# Altium project OurEDA-P1K.PrjPcb
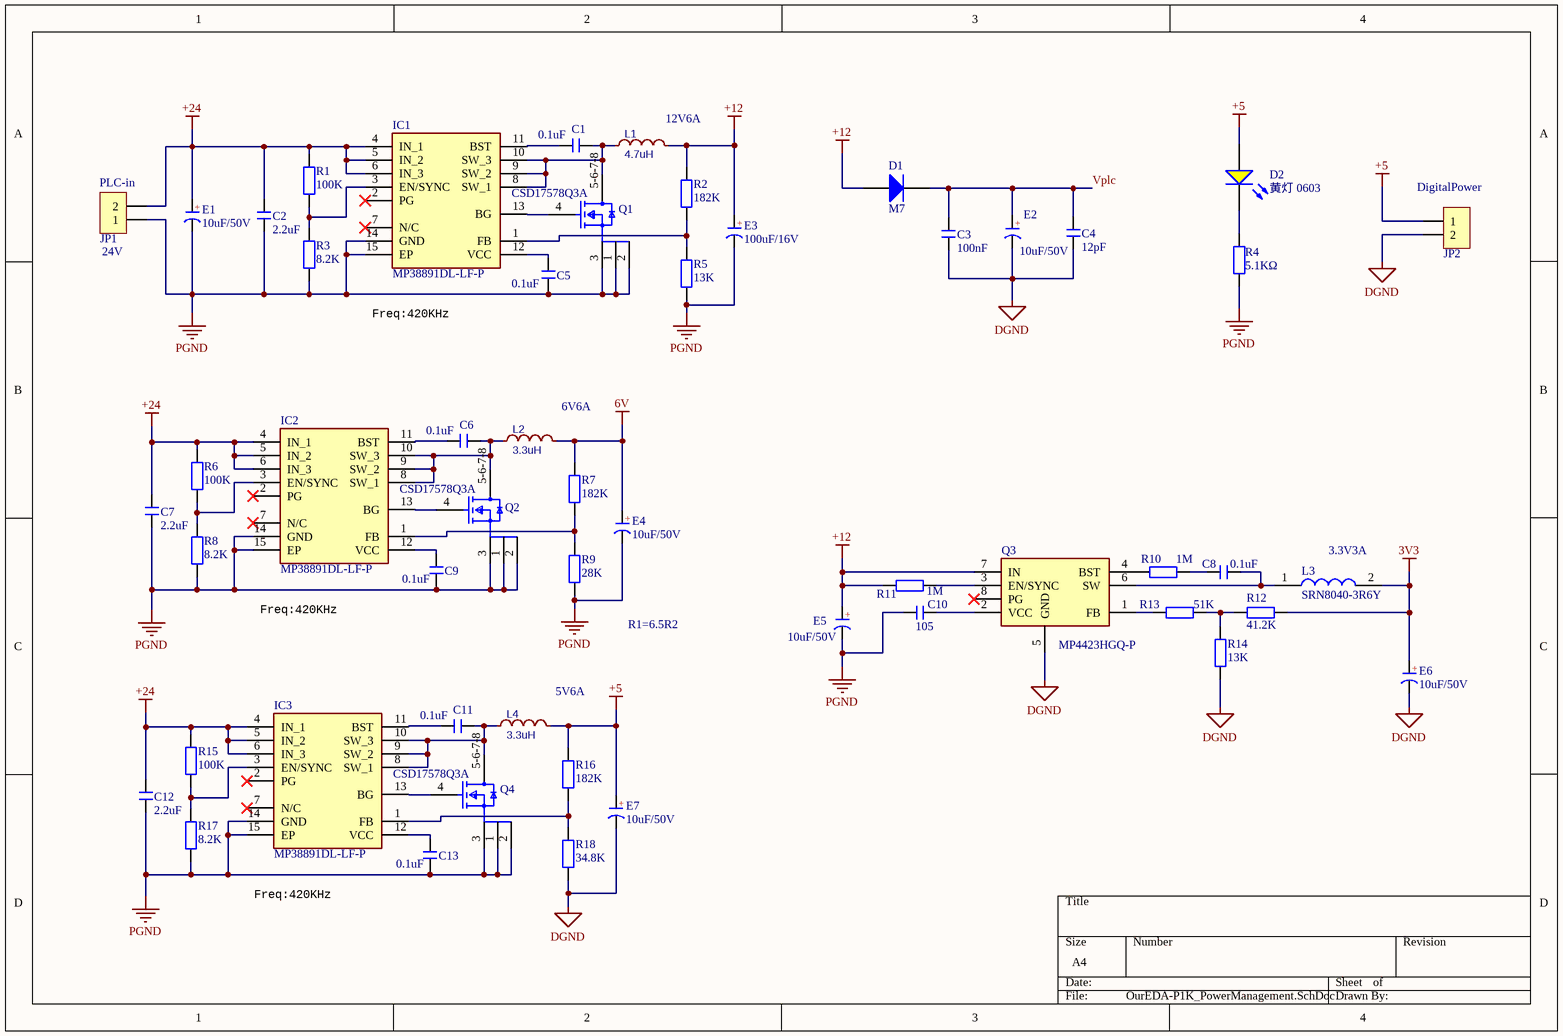
[diagram p0: OurEDA-P1K_PowerManagement.SchDoc]
7 sheets, 226 parts. Net scope: global (net labels, ports and power ports of the same name join across sheets).
Board file: OurEDA-P1K.PcbDoc
Sheets:
  OurEDA-P1K_PowerManagement.SchDoc
  OurEDA-P1K_Network.SchDoc
  OurEDA-P1K_zynq.SchDoc
  OurEDA-P1K_sensor.SchDoc
  OurEDA-P1K_cam.SchDoc
  OurEDA-P1K_usb.SchDoc
  OurEDA-P1K_sd.SchDoc

## Sheet OurEDA-P1K_PowerManagement.SchDoc
size A4; SheetNumber: 1; SheetTotal: 7

### Parts
C1  0.1uF  [C 0603_L]
C2  2.2uF  [C 0805_L]
C3  100nF  [C 0603_L]
C4  12pF  [C 0603_L]
C5  0.1uF  [C 0603_L]
C6  0.1uF  [C 0603_L]
C7  2.2uF  [C 0805_L]
C8  0.1uF  [C 0603_L]
C9  0.1uF  [C 0603_L]
C10  105  [C 0603_L]
C11  0.1uF  [C 0603_L]
C12  2.2uF  [C 0805_L]
C13  0.1uF  [C 0603_L]
D1  M7  [SMA(DO-214AC)_S1]
D2  黄灯 0603  [0603_LED_S1]
E1  10uF/50V  [CM D(6.3*5.4)]
E2  10uF/50V  [CM B(4*5.4)]
E3  100uF/16V  [CM D(6.3*5.4)]
E4  10uF/50V  [CM B(4*5.4)]
E5  10uF/50V  [CM B(4*5.4)]
E6  10uF/50V  [CM B(4*5.4)]
E7  10uF/50V  [CM B(4*5.4)]
IC1  MP38891DL-LF-P  [SON50P300X400X100-15N-D]
IC2  MP38891DL-LF-P  [SON50P300X400X100-15N-D]
IC3  MP38891DL-LF-P  [SON50P300X400X100-15N-D]
JP1  HDR-1X2  [KF128-5.08-2P]  (value not drawn)
JP2  HDR-1X2  [HDR2.54-LI-2P]  (value not drawn)
L1  4.7uH  [220uH]
L2  3.3uH  [220uH]
L3  SRN8040-3R6Y  [SRN80408R2Y]
L4  3.3uH  [220uH]
Q1  CSD17578Q3A  [FP-DNH0008A-MFG]
Q2  CSD17578Q3A  [FP-DNH0008A-MFG]
Q3  MP4423HGQ-P  [MP4423GQP]
Q4  CSD17578Q3A  [FP-DNH0008A-MFG]
R1  100K  [R 0603_L]
R2  182K  [R 0603_L]
R3  8.2K  [R 0603_L]
R4  5.1KΩ  [0603_R]
R5  13K  [R 0603_L]
R6  100K  [R 0603_L]
R7  182K  [R 0603_L]
R8  8.2K  [R 0603_L]
R9  28K  [R 0603_L]
R10  1M  [R 0603_L]
R11  1M  [R 0603_L]
R12  41.2K  [R 0603_L]
R13  51K  [R 0603_L]
R14  13K  [R 0603_L]
R15  100K  [R 0603_L]
R16  182K  [R 0603_L]
R17  8.2K  [R 0603_L]
R18  34.8K  [R 0603_L]

### Nets
3V3: E6.1(A) L3.2 R12.2
6V: E4.1(A) L2.2 R7.2
+5: D2.A E7.1(A) JP2.1 L4.2 R16.2
+12: D1.1(A) E3.1(A) E5.1(A) L1.2 Q3.7(IN) R2.2 R11.2
+24: C2.2 C7.2 C12.2 E1.1(A) IC1.4(IN_1) IC1.5(IN_2) IC1.6(IN_3) IC2.4(IN_1) IC2.5(IN_2) IC2.6(IN_3) IC3.4(IN_1) IC3.5(IN_2) IC3.6(IN_3) JP1.2 R1.2 R6.2 R15.2
DGND: C3.2 C4.2 E2.2(K) E6.2(K) E7.2(K) JP2.2 Q3.5(GND) R14.2 R18.1
PGND: C2.1 C5.2 C7.1 C9.2 C10.1 C12.1 C13.2 E1.2(K) E3.2(K) E4.2(K) E5.2(K) IC1.14(GND) IC1.15(EP) IC2.14(GND) IC2.15(EP) IC3.14(GND) IC3.15(EP) JP1.1 Q1.1(S) Q1.2(S) Q1.3(S) Q2.1(S) Q2.2(S) Q2.3(S) Q4.1(S) Q4.2(S) Q4.3(S) R3.1 R4.2 R5.1 R8.1 R9.1 R17.1
Vplc: C3.1 C4.1 D1.2(K) E2.1(A)
NetC1_1: C1.1 IC1.8(SW_1) IC1.9(SW_2) IC1.10(SW_3) L1.1 Q1.5-6-7-8(D)
NetC1_2: C1.2 IC1.11(BST)
NetC5_1: C5.1 IC1.12(VCC)
NetC6_1: C6.1 IC2.8(SW_1) IC2.9(SW_2) IC2.10(SW_3) L2.1 Q2.5-6-7-8(D)
NetC6_2: C6.2 IC2.11(BST)
NetC8_1: C8.1 L3.1 Q3.6(SW)
NetC8_2: C8.2 R10.1
NetC9_1: C9.1 IC2.12(VCC)
NetC10_2: C10.2 Q3.2(VCC)
NetC11_1: C11.1 IC3.8(SW_1) IC3.9(SW_2) IC3.10(SW_3) L4.1 Q4.5-6-7-8(D)
NetC11_2: C11.2 IC3.11(BST)
NetC13_1: C13.1 IC3.12(VCC)
NetD2_K: D2.K R4.1
NetIC1_1: IC1.1(FB) R2.1 R5.2
NetIC1_3: IC1.3(EN/SYNC) R1.1 R3.2
NetIC1_13: IC1.13(BG) Q1.4(G)
NetIC2_1: IC2.1(FB) R7.1 R9.2
NetIC2_3: IC2.3(EN/SYNC) R6.1 R8.2
NetIC2_13: IC2.13(BG) Q2.4(G)
NetIC3_1: IC3.1(FB) R16.1 R18.2
NetIC3_3: IC3.3(EN/SYNC) R15.1 R17.2
NetIC3_13: IC3.13(BG) Q4.4(G)
NetQ3_1: Q3.1(FB) R13.2
NetQ3_3: Q3.3(EN/SYNC) R11.1
NetQ3_4: Q3.4(BST) R10.2
NetR12_1: R12.1 R13.1 R14.1

Not connected (* = marked no-connect by the designer): IC1 2(PG)* 7(N/C)*; IC2 2(PG)* 7(N/C)*; IC3 2(PG)* 7(N/C)*; Q3 8(PG)*

### Notes on the sheet
- (near L1) 12V6A
- (near JP1) PLC-in
- (near JP2) DigitalPower
- (near JP1) 24V
- Freq:420KHz
- (near L2) 6V6A
- (near L3) 3.3V3A
- R1=6.5R2
- (near L4) 5V6A
- (in symbol C-CM) +

### Library data of the parts
C1-C13 = C: 无极性贴片电容; 版权归属: 源创客; BOM名称: 无极性贴片电容; 学习资源: www.ooocke.com
D1 = SMA(DO-214AC) M7: 二极管; Notepad: 1N4007 4007 编号C2464 已经停售, 使用新物料编号C95872; ComponentLink1Description: 供应商链接; ComponentLink1URL: http://www.szlcsc.com/product/details_2841.html; Package: SMA(DO-214AC); Supplier: LC; SuppliersPartNumber: C95872
D2 = 0603 黄灯: 发光二极管; ComponentLink1Description: 供应商链接; ComponentLink1URL: http://www.szlcsc.com/product/details_73147.html; Package: 0603; Supplier: LC; SuppliersPartNumber: C72038
E1-E7 = C-CM: 贴片电解电容; 版权归属: 源创客; BOM名称: 贴片电解电容; 学习资源: www.ooocke.com
IC1-IC3 = MP38891DL-LF-P: Integrated Circuit; Manufacturer_Name: Monolithic Power Systems (MPS); Datasheet Link: https://componentsearchengine.com/Datasheets/1/MP38891DL-LF-P.pdf; Height: 1mm; Manufacturer_Part_Number: MP38891DL-LF-P; Mouser Part Number: 946-MP38891DLLFP; Mouser Price/Stock: https://www.mouser.com/Search/Refine.aspx?Keyword=946-MP38891DLLFP
JP1 JP2 = Header 2: 2P接插件; 版权归属: 源创客; BOM名称: 2P接插件; 学习资源: www.ooocke.com
L1 L2 L4 = 220uH: BOM_Manufacturer: Sunltech Tech; BOM_Manufacturer Part: SLO1235H220MTT; nameAlias: Inductance; Contributor: LCSC; BOM_Supplier: LCSC; BOM_Supplier Part: C364099; spicePre: L; spiceSymbolName: SLO1235H220MTT
L3 = SRN8040-3R6Y: Inductor; Manufacturer_Name: Bourns; Datasheet Link: https://www.bourns.com/docs/Product-Datasheets/SRN8040.pdf; Height: 4mm; Manufacturer_Part_Number: SRN8040-3R6Y; Arrow Part Number: SRN8040-3R6Y; Arrow Price/Stock: https://www.arrow.com/en/products/srn8040-3r6y/bourns; Mouser Part Number: 652-SRN8040-3R6Y; Mouser Price/Stock: https://www.mouser.com/Search/Refine.aspx?Keyword=652-SRN8040-3R6Y
Q1 Q2 Q4 = CMP-04962-000065-1: MOSFET N-CH 30V 35A 8VSON; Turn-On Delay Time: 2ns; Rds On Max: 7.3mR; Fall Time: 1ns; Gate to Source Voltage (Vgs): 20V; Turn-Off Delay Time: 13ns; Rise Time: 6ns; Max Power Dissipation: 3.2W; Input Capacitance: 1.59nF; Element Configuration: Single; Continuous Drain Current (ID): 20A; Drain to Source Voltage (Vdss): 30V; Packaging: Tape and Reel; Lead Free: Lead Free; Mount: Surface Mount; Number of Pins: 8; Contact Plating: Copper; Min Operating Temperature: -55°C; Max Operating Temperature: 150°C; RoHS Compliant: Yes
Q3 = MP4423HGQ-P: Transistor; Manufacturer_Name: Monolithic Power Systems (MPS); Datasheet Link: https://componentsearchengine.com/Datasheets/1/MP4423HGQ-P.pdf; Height: 1mm; Manufacturer_Part_Number: MP4423HGQ-P; Mouser Part Number: 946-MP4423HGQ-P; Mouser Price/Stock: https://www.mouser.co.uk/ProductDetail/Monolithic-Power-Systems-MPS/MP4423HGQ-P?qs=493kPxzlxfL2LSjJYToBPQ%3D%3D
R1-R3 R5-R18 = R: 贴片电阻; 版权归属: 源创客; BOM名称: 贴片电阻; 学习资源: www.ooocke.com
R4 = 0603 3.3KΩ (3301) 1%: 贴片电阻; ComponentLink1Description: 供应商链接; ComponentLink1URL: http://www.szlcsc.com/product/details_23705.html; Package: 0603; Supplier: LC; SuppliersPartNumber: C22978

## Sheet OurEDA-P1K_Network.SchDoc
size A4; SheetNumber: 2; SheetTotal: 7
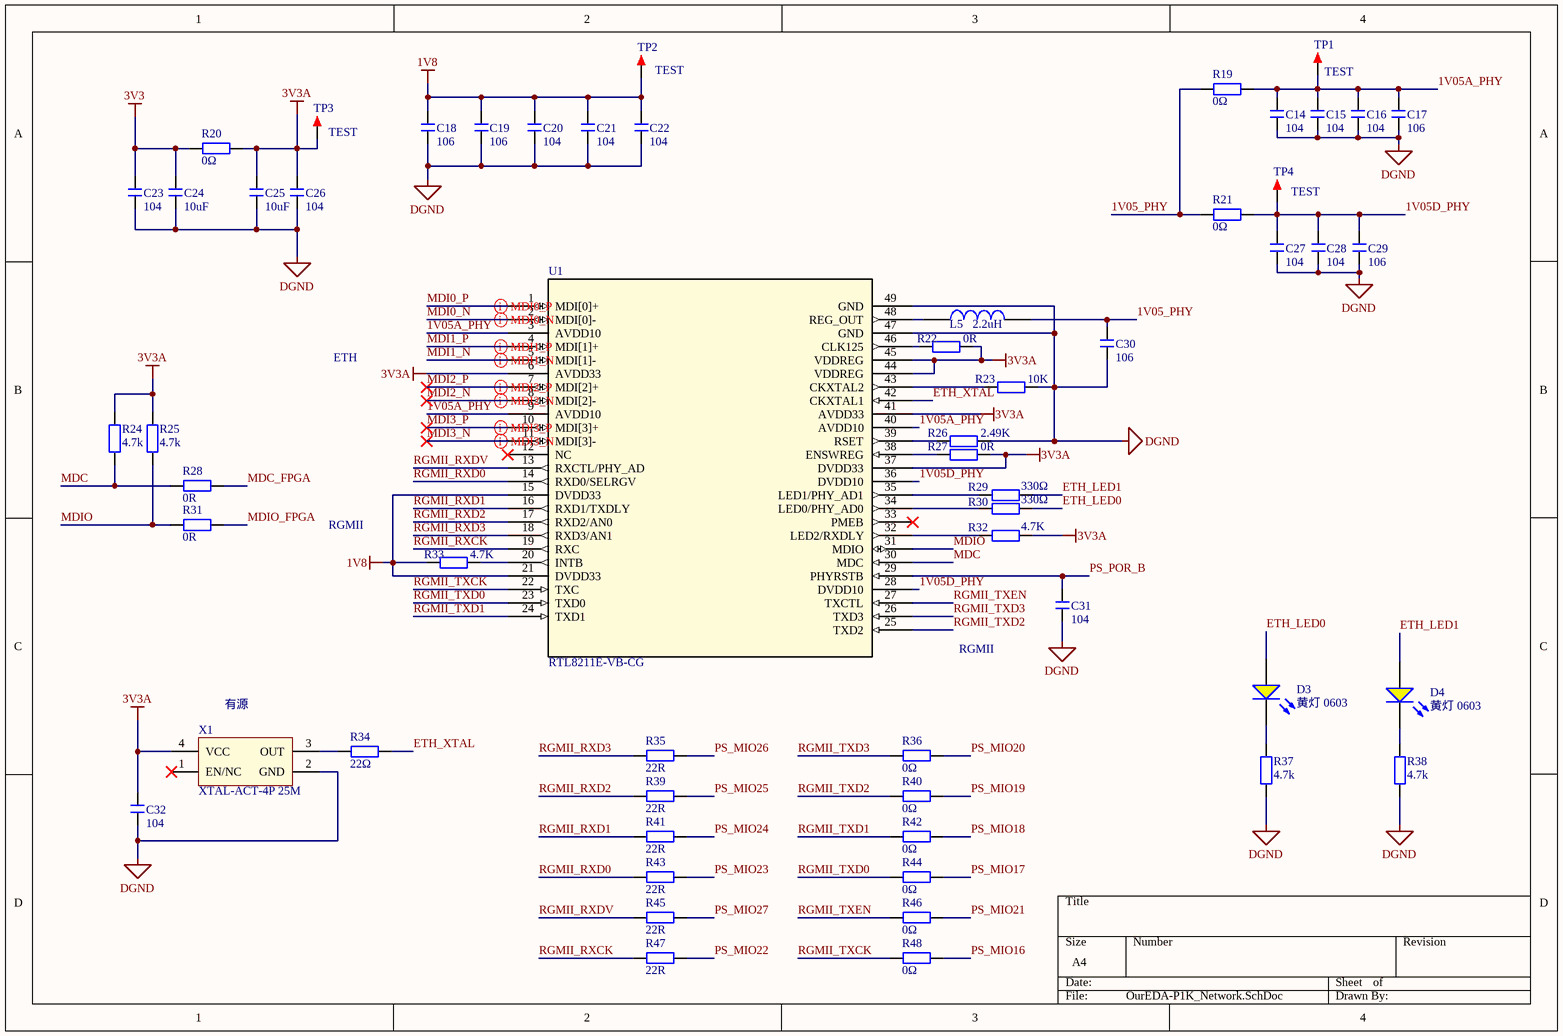
[diagram p1: OurEDA-P1K_Network.SchDoc]

### Parts
C14  104  [C 0603_L]
C15  104  [C 0603_L]
C16  104  [C 0603_L]
C17  106  [C 0603_L]
C18  106  [C 0603_L]
C19  106  [C 0603_L]
C20  104  [C 0603_L]
C21  104  [C 0603_L]
C22  104  [C 0603_L]
C23  104  [C 0603_L]
C24  10uF  [C 0603_L]
C25  10uF  [C 0603_L]
C26  104  [C 0603_L]
C27  104  [C 0603_L]
C28  104  [C 0603_L]
C29  106  [C 0603_L]
C30  106  [C 0603_L]
C31  104  [C 0603_L]
C32  104  [C 0603_L]
D3  黄灯 0603  [0603_LED_S1]
D4  黄灯 0603  [0603_LED_S1]
L5  2.2uH  [0805L]
R19  0Ω  [R 0603_L]
R20  0Ω  [R 0805_L]
R21  0Ω  [R 0603_L]
R22  0R  [R 0603_L]
R23  10K  [R 0603_L]
R24  4.7k  [R 0603_L]
R25  4.7k  [R 0603_L]
R26  2.49K  [R 0603_L]
R27  0R  [R 0603_L]
R28  0R  [R 0603_L]
R29  330Ω  [R 0603_L]
R30  330Ω  [R 0603_L]
R31  0R  [R 0603_L]
R32  4.7K  [R 0603_L]
R33  4.7K  [R 0603_L]
R34  22Ω  [R 0603_L]
R35  22R  [R 0603_L]
R36  0Ω  [R 0603_L]
R37  4.7k  [R 0603_L]
R38  4.7k  [R 0603_L]
R39  22R  [R 0603_L]
R40  0Ω  [R 0603_L]
R41  22R  [R 0603_L]
R42  0Ω  [R 0603_L]
R43  22R  [R 0603_L]
R44  0Ω  [R 0603_L]
R45  22R  [R 0603_L]
R46  0Ω  [R 0603_L]
R47  22R  [R 0603_L]
R48  0Ω  [R 0603_L]
TP1  TEST  [TEST 1]
TP2  TEST  [TEST 1]
TP3  TEST  [TEST 1]
TP4  TEST  [TEST 1]
U1  RTL8211E-VB-CG  [QFN48 6X6]
X1  XTAL-ACT-4P 25M  [OSC 1612-4P]

### Nets
1V8: C18.2 C19.2 C20.2 C21.2 C22.2 R33.2 TP2.1 U1.15(DVDD33) U1.21(DVDD33)
3V3: C23.2 C24.2 R20.1
3V3A: C25.2 C26.2 C32.2 R20.2 R22.1 R24.1 R25.1 R27.1 R32.1 TP3.1 U1.6(AVDD33) U1.37(DVDD33) U1.41(AVDD33) U1.44(VDDREG) U1.45(VDDREG) X1.4(VCC)
DGND: C14.1 C15.1 C16.1 C17.1 C18.1 C19.1 C20.1 C21.1 C22.1 C23.1 C24.1 C25.1 C26.1 C27.1 C28.1 C29.1 C30.2 C31.2 C32.1 R23.1 R26.1 R37.1 R38.1 U1.47(GND) U1.49(GND) X1.2(GND)
1V05_PHY: C30.1 L5.2 R19.1 R21.1
1V05A_PHY: C14.2 C15.2 C16.2 C17.2 R19.2 TP1.1 U1.3(AVDD10) U1.9(AVDD10) U1.40(AVDD10)
1V05D_PHY: C27.2 C28.2 C29.2 R21.2 TP4.1 U1.28(DVDD10) U1.36(DVDD10)
ETH_LED0: D3.A R30.1
ETH_LED1: D4.A R29.1
ETH_XTAL: R34.2 U1.42(CKXTAL1)
MDC: R24.2 R28.2 U1.30(MDC)
MDC_FPGA: R28.1
MDI0_N: U1.2(MDI[0]-)
MDI0_P: U1.1(MDI[0]+)
MDI1_N: U1.5(MDI[1]-)
MDI1_P: U1.4(MDI[1]+)
MDI2_N: U1.8(MDI[2]-)
MDI2_P: U1.7(MDI[2]+)
MDI3_N: U1.11(MDI[3]-)
MDI3_P: U1.10(MDI[3]+)
MDIO: R25.2 R31.2 U1.31(MDIO)
MDIO_FPGA: R31.1
PS_MIO16: R48.2
PS_MIO17: R44.2
PS_MIO18: R42.2
PS_MIO19: R40.2
PS_MIO20: R36.2
PS_MIO21: R46.2
PS_MIO22: R47.2
PS_MIO23: R43.2
PS_MIO24: R41.2
PS_MIO25: R39.2
PS_MIO26: R35.2
PS_MIO27: R45.2
PS_POR_B: C31.1 U1.29(PHYRSTB)
RGMII_RXCK: R47.1 U1.19(RXC)
RGMII_RXD0: R43.1 U1.14(RXD0/SELRGV)
RGMII_RXD1: R41.1 U1.16(RXD1/TXDLY)
RGMII_RXD2: R39.1 U1.17(RXD2/AN0)
RGMII_RXD3: R35.1 U1.18(RXD3/AN1)
RGMII_RXDV: R45.1 U1.13(RXCTL/PHY_AD)
RGMII_TXCK: R48.1 U1.22(TXC)
RGMII_TXD0: R44.1 U1.23(TXD0)
RGMII_TXD1: R42.1 U1.24(TXD1)
RGMII_TXD2: R40.1 U1.25(TXD2)
RGMII_TXD3: R36.1 U1.26(TXD3)
RGMII_TXEN: R46.1 U1.27(TXCTL)
NetD3_K: D3.K R37.2
NetD4_K: D4.K R38.2
NetL5_1: L5.1 U1.48(REG_OUT)
NetR22_2: R22.2 U1.46(CLK125)
NetR23_2: R23.2 U1.43(CKXTAL2)
NetR26_2: R26.2 U1.39(RSET)
NetR27_2: R27.2 U1.38(ENSWREG)
NetR29_2: R29.2 U1.35(LED1/PHY_AD1)
NetR30_2: R30.2 U1.34(LED0/PHY_AD0)
NetR32_2: R32.2 U1.32(LED2/RXDLY)
NetR33_1: R33.1 U1.20(INTB)
NetR34_1: R34.1 X1.3(OUT)

Not connected (* = marked no-connect by the designer): U1 12(NC)* 33(PMEB)*; X1 1(EN/NC)*

### Layout directives
differential pair: MDI0_N, MDI0_P, MDI1_N, MDI1_P, MDI2_N, MDI2_P, MDI3_N, MDI3_P

### Notes on the sheet
- ETH
- RGMII
- (near X1) 有源

### Library data of the parts
C14-C32 = C: 无极性贴片电容; 版权归属: 源创客; BOM名称: 无极性贴片电容; 学习资源: www.ooocke.com
D3 D4 = 0603 黄灯: 发光二极管; ComponentLink1Description: 供应商链接; ComponentLink1URL: http://www.szlcsc.com/product/details_73147.html; Package: 0603; Supplier: LC; SuppliersPartNumber: C72038
L5 = INDUCTOR
R19-R48 = R: 贴片电阻; 版权归属: 源创客; BOM名称: 贴片电阻; 学习资源: www.ooocke.com
TP1-TP4 = TEST: 测试点; 版权归属: 源创客; BOM名称: 测试点; 学习资源: www.ooocke.com
U1 = RTL8211E-VB-CG: No Description Available; Mfr_Name: Realtek; Copyright: Copyright (C) 2022 Ultra Librarian. All rights reserved.; Manufacturer_Part_Number: RTL8211E-VB-CG; RefDes: RefDes; Type: DEV
X1 = XTAL-ACT-4P: 4脚有源晶振

## Sheet OurEDA-P1K_zynq.SchDoc
size A4; SheetNumber: 3; SheetTotal: 7
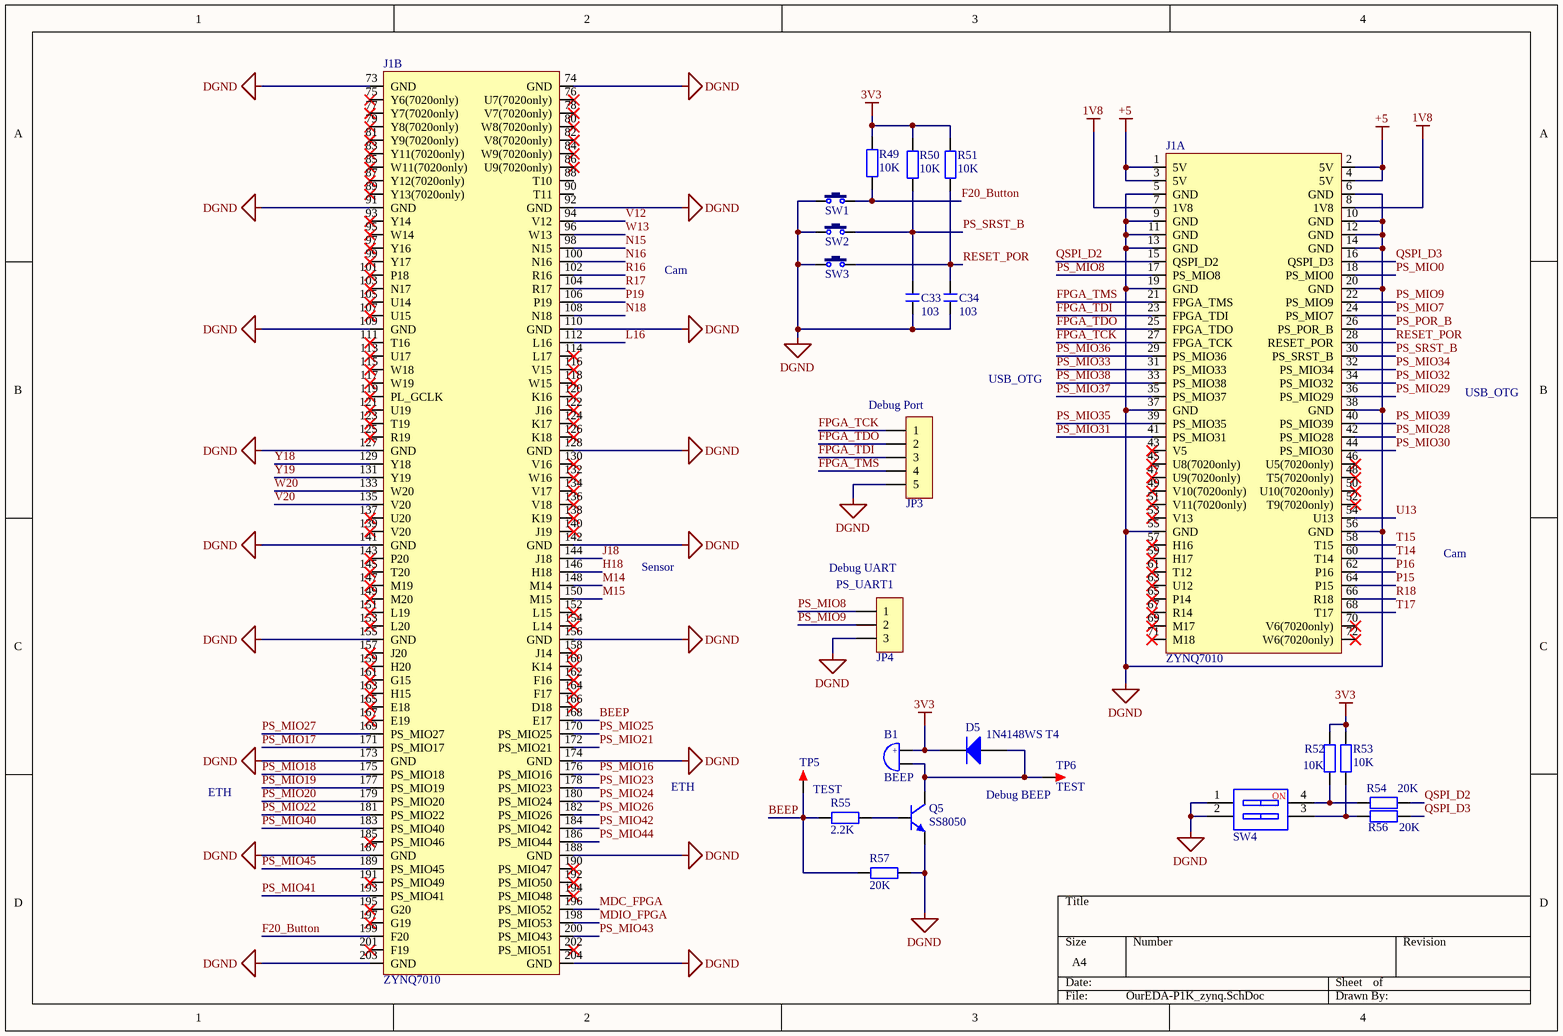
[diagram p2: OurEDA-P1K_zynq.SchDoc]

### Parts
B1  BEEP  [BEEP 5x9x5.5]
C33  103  [C 0603_L]
C34  103  [C 0603_L]
D5  1N4148WS T4  [SOD-323]
J1  ZYNQ7010  [DDR3_sodimm_Pin204]  (parts A,B of 2)
JP3  HDR-1X5  [MX 1.25-LS-5P]  (value not drawn)
JP4  HDR-1X3  [MX 1.25-LS-3P]  (value not drawn)
Q5  SS8050  [SOT23-3N]
R49  10K  [R 0603_L]
R50  10K  [R 0603_L]
R51  10K  [R 0603_L]
R52  10K  [R 0603_L]
R53  10K  [R 0603_L]
R54  20K  [R 0603_L]
R55  2.2K  [R 0603_L]
R56  20K  [R 0603_L]
R57  20K  [R 0603_L]
SW1  3x6x5  [TSW SMD-3*6*2.5]  (value not drawn)
SW2  3x6x5  [TSW SMD-3*6*2.5]  (value not drawn)
SW3  3x6x5  [TSW SMD-3*6*2.5]  (value not drawn)
SW4  CSW-2P  [CSW1.27 SMD-2P]  (value not drawn)
TP5  TEST  [TEST 1]
TP6  TEST  [TEST 1]

### Nets
1V8: J1.7(1V8) J1.8(1V8)
3V3: B1.1 D5.2(K) R49.2 R50.2 R51.2 R52.2 R53.2
+5: J1.1(5V) J1.2(5V) J1.3(5V) J1.4(5V)
DGND: C33.1 C34.1 J1.5(GND) J1.6(GND) J1.9(GND) J1.10(GND) J1.11(GND) J1.12(GND) J1.13(GND) J1.14(GND) J1.19(GND) J1.20(GND) J1.37(GND) J1.38(GND) J1.55(GND) J1.56(GND) J1.73(GND) J1.74(GND) J1.91(GND) J1.92(GND) J1.109(GND) J1.110(GND) J1.127(GND) J1.128(GND) J1.141(GND) J1.142(GND) J1.155(GND) J1.156(GND) J1.173(GND) J1.174(GND) J1.187(GND) J1.188(GND) J1.203(GND) J1.204(GND) JP3.5 JP4.3 Q5.2(E) R57.2 SW1.1 SW2.1 SW3.1 SW4.1 SW4.2
BEEP: J1.168(E17) R55.2 R57.1 TP5.1
F20_Button: J1.199(F20) R49.1 SW1.2
FPGA_TCK: J1.27(FPGA_TCK) JP3.1
FPGA_TDI: J1.23(FPGA_TDI) JP3.3
FPGA_TDO: J1.25(FPGA_TDO) JP3.2
FPGA_TMS: J1.21(FPGA_TMS) JP3.4
H18: J1.146(H18)
J18: J1.144(J18)
L16: J1.112(L16)
M14: J1.148(M14)
M15: J1.150(M15)
MDC_FPGA: J1.196(PS_MIO52)
MDIO_FPGA: J1.198(PS_MIO53)
N15: J1.98(N15)
N16: J1.100(N16)
N18: J1.108(N18)
P15: J1.64(P15)
P16: J1.62(P16)
P19: J1.106(P19)
PS_MIO0: J1.18(PS_MIO0)
PS_MIO7: J1.24(PS_MIO7)
PS_MIO8: J1.17(PS_MIO8) JP4.1
PS_MIO9: J1.22(PS_MIO9) JP4.2
PS_MIO16: J1.176(PS_MIO16)
PS_MIO17: J1.171(PS_MIO17)
PS_MIO18: J1.175(PS_MIO18)
PS_MIO19: J1.177(PS_MIO19)
PS_MIO20: J1.179(PS_MIO20)
PS_MIO21: J1.172(PS_MIO21)
PS_MIO22: J1.181(PS_MIO22)
PS_MIO23: J1.178(PS_MIO23)
PS_MIO24: J1.180(PS_MIO24)
PS_MIO25: J1.170(PS_MIO25)
PS_MIO26: J1.182(PS_MIO26)
PS_MIO27: J1.169(PS_MIO27)
PS_MIO28: J1.42(PS_MIO28)
PS_MIO29: J1.36(PS_MIO29)
PS_MIO30: J1.44(PS_MIO30)
PS_MIO31: J1.41(PS_MIO31)
PS_MIO32: J1.34(PS_MIO32)
PS_MIO33: J1.31(PS_MIO33)
PS_MIO34: J1.32(PS_MIO34)
PS_MIO35: J1.39(PS_MIO35)
PS_MIO36: J1.29(PS_MIO36)
PS_MIO37: J1.35(PS_MIO37)
PS_MIO38: J1.33(PS_MIO38)
PS_MIO39: J1.40(PS_MIO39)
PS_MIO40: J1.183(PS_MIO40)
PS_MIO41: J1.193(PS_MIO41)
PS_MIO42: J1.184(PS_MIO42)
PS_MIO43: J1.200(PS_MIO43)
PS_MIO44: J1.186(PS_MIO44)
PS_MIO45: J1.189(PS_MIO45)
PS_POR_B: J1.26(PS_POR_B)
PS_SRST_B: C33.2 J1.30(PS_SRST_B) R50.1 SW2.2
QSPI_D2: J1.15(QSPI_D2) R54.2
QSPI_D3: J1.16(QSPI_D3) R56.2
R16: J1.102(R16)
R17: J1.104(R17)
R18: J1.66(R18)
RESET_POR: C34.2 J1.28(RESET_POR) R51.1 SW3.2
T14: J1.60(T14)
T15: J1.58(T15)
T17: J1.68(T17)
U13: J1.54(U13)
V12: J1.94(V12)
V20: J1.135(V20)
W13: J1.96(W13)
W20: J1.133(W20)
Y18: J1.129(Y18)
Y19: J1.131(Y19)
NetB1_2: B1.2 D5.1(A) Q5.3(C) TP6.1
NetQ5_1: Q5.1(B) R55.1
NetR52_1: R52.1 R54.1 SW4.4
NetR53_1: R53.1 R56.1 SW4.3

Not connected (* = marked no-connect by the designer): J1 43(V5)* 45(U8(7020only))* 46(U5(7020only))* 47(U9(7020only))* 48(T5(7020only))* 49(V10(7020only))* 50(U10(7020only))* 51(V11(7020only))* 52(T9(7020only))* 53(V13)* 57(H16)* 59(H17)* 61(T12)* 63(U12)* 65(P14)* 67(R14)* 69(M17)* 70(V6(7020only))* 71(M18)* 72(W6(7020only))* 75(Y6(7020only))* 76(U7(7020only))* 77(Y7(7020only))* 78(V7(7020only))* 79(Y8(7020only))* 80(W8(7020only))* 81(Y9(7020only))* 82(V8(7020only))* 83(Y11(7020only))* 84(W9(7020only))* 85(W11(7020only))* 86(U9(7020only))* 87(Y12(7020only))* 88(T10) 89(Y13(7020only))* 90(T11) 93(Y14)* 95(W14)* 97(Y16)* 99(Y17)* 101(P18)* 103(N17)* 105(U14)* 107(U15)* 111(T16)* 113(U17)* 114(L17)* 115(W18)* 116(V15)* 117(W19)* 118(W15)* 119(PL_GCLK)* 120(K16)* 121(U19)* 122(J16)* 123(T19)* 124(K17)* 125(R19)* 126(K18)* 130(V16)* 132(W16)* 134(V17)* 136(V18)* 137(U20)* 138(K19)* 139(V20)* 140(J19)* 143(P20)* 145(T20)* 147(M19)* 149(M20)* 151(L19)* 152(L15)* 153(L20)* 154(L14)* 157(J20)* 158(J14)* 159(H20)* 160(K14)* 161(G15)* 162(F16)* 163(H15)* 164(F17)* 165(E18)* 166(D18)* 167(E19)* 185(PS_MIO46)* 190(PS_MIO47)* 191(PS_MIO49)* 192(PS_MIO50)* 194(PS_MIO48)* 195(G20)* 197(G19)* 201(F19)* 202(PS_MIO51)*

### Notes on the sheet
- Cam
- USB_OTG
- (near JP3) Debug Port
- Sensor
- (near JP4) Debug UART
- (near JP4) PS_UART1
- ETH
- (near TP6) Debug BEEP
- (in symbol BEEP) +
- (in symbol CSW-2P) NO

### Library data of the parts
B1 = BEEP: 蜂鸣器
C33 C34 = C: 无极性贴片电容; 版权归属: 源创客; BOM名称: 无极性贴片电容; 学习资源: www.ooocke.com
D5 = SOD-323 1N4148WS T4: 二极管; ComponentLink1Description: 供应商链接; ComponentLink1URL: http://www.szlcsc.com/product/details_2485.html; Package: SOD-323; Supplier: LC; SuppliersPartNumber: C2128
J1 = DDR3_sodimm_Pin204
JP3 = Header 5: 5P接插件; 版权归属: 源创客; BOM名称: 5P接插件; 学习资源: www.ooocke.com
JP4 = Header 3: 3P接插件; 版权归属: 源创客; BOM名称: 3P接插件; 学习资源: www.ooocke.com
Q5 = 8050-SMD: 高频放大-NPN型; 版权归属: 源创客; 属性: 40V 1.5A 1W 100MHZ; BOM名称: 高频放大-NPN型; 学习资源: www.ooocke.com
R49-R57 = R: 贴片电阻; 版权归属: 源创客; BOM名称: 贴片电阻; 学习资源: www.ooocke.com
SW1-SW3 = TSW 3x6: 3x6轻触开关; 版权归属: 源创客; BOM名称: 3x6轻触开关; 学习资源: www.ooocke.com
SW4 = CSW-2P: 2路编码开关; 版权归属: 源创客; BOM名称: 2路编码开关; 学习资源: www.ooocke.com
TP5 TP6 = TEST: 测试点; 版权归属: 源创客; BOM名称: 测试点; 学习资源: www.ooocke.com

## Sheet OurEDA-P1K_sensor.SchDoc
size A4; SheetNumber: 4; SheetTotal: 7
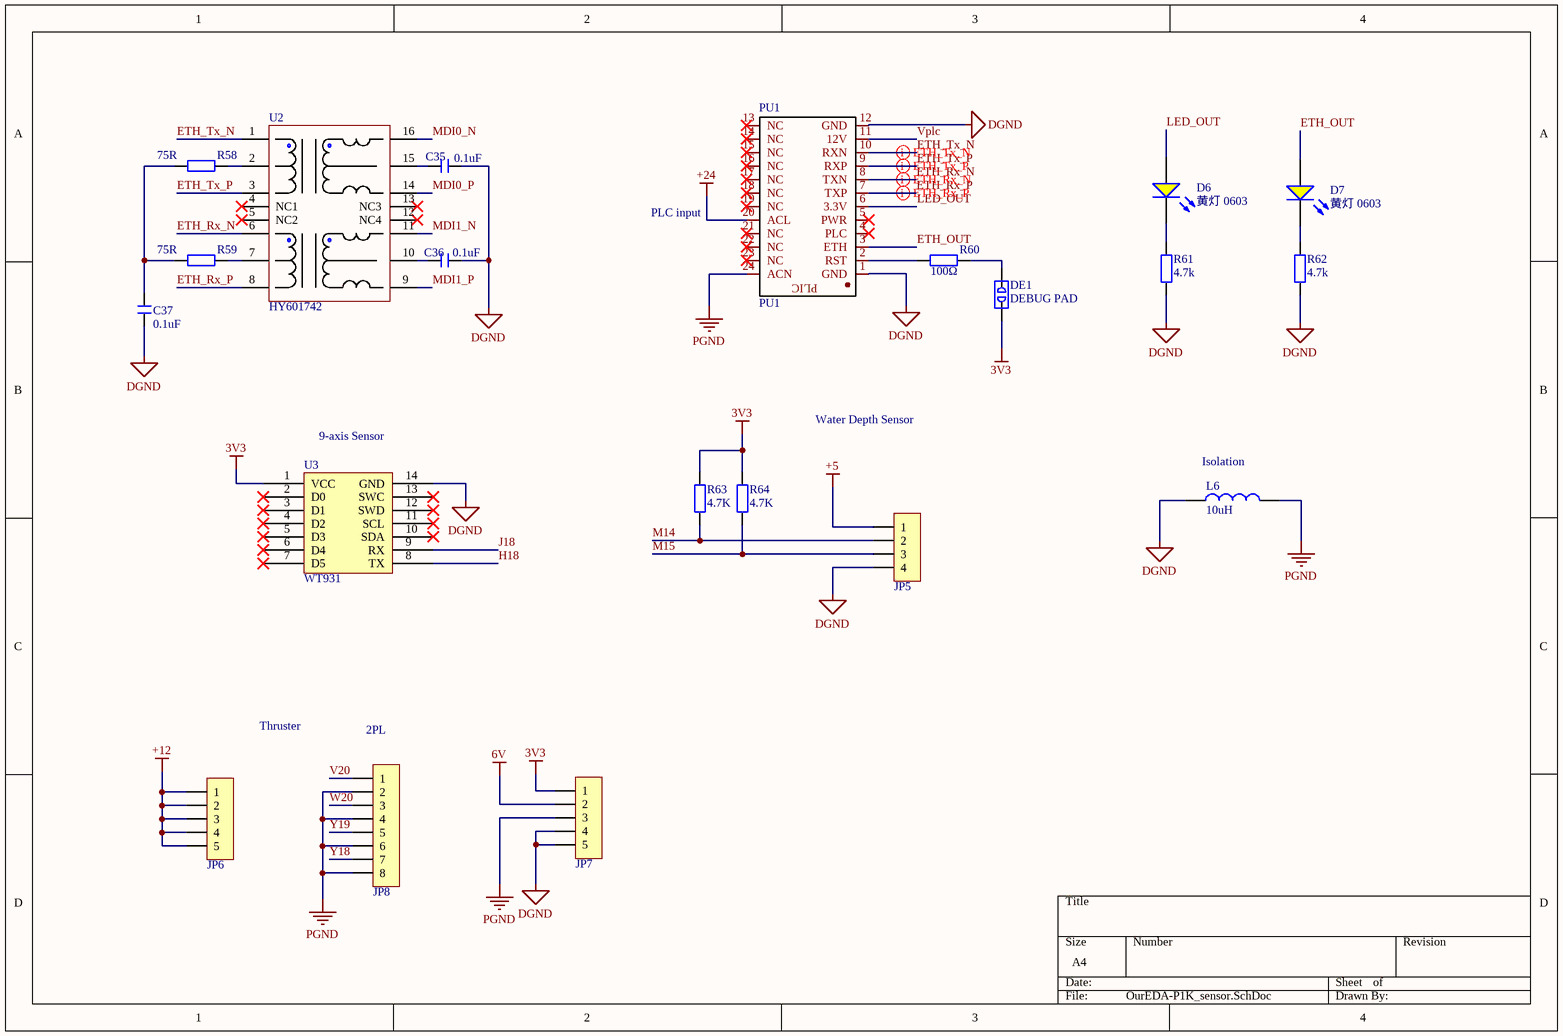
[diagram p3: OurEDA-P1K_sensor.SchDoc]

### Parts
C35  0.1uF  [C 0603_L]
C36  0.1uF  [C 0603_L]
C37  0.1uF  [C 0603_L]
D6  黄灯 0603  [0603_LED_S1]
D7  黄灯 0603  [0603_LED_S1]
DE1  DEBUG PAD  [DEBUG_A]
JP5  HDR-1X4  [MX 1.25-LI-4P]  (value not drawn)
JP6  HDR-1X5  [KF128-5.08-5P]  (value not drawn)
JP7  HDR-1X5  [KF128-5.08-5P]  (value not drawn)
JP8  HDR-1X8  [KF128-5.08-8P]  (value not drawn)
L6  10uH  [L 0805]
PU1  PU1  [LW-MPA223A]
R58  75R  [0603_R]
R59  75R  [0603_R]
R60  100Ω  [0603_R]
R61  4.7k  [R 0603_L]
R62  4.7k  [R 0603_L]
R63  4.7K  [R 0603_L]
R64  4.7K  [R 0603_L]
U2  HY601742  [SOP-16_350mil]
U3  WT931  [WT931]

### Nets
3V3: DE1.1 JP7.1 R63.2 R64.2 U3.1(VCC)
6V: JP7.2
+5: JP5.1
+12: JP6.1 JP6.2 JP6.3 JP6.4 JP6.5
+24: PU1.20(ACL)
DGND: C35.1 C36.1 C37.1 JP5.4 JP7.4 JP7.5 L6.1 PU1.1(GND) PU1.12(GND) R61.1 R62.1 U3.14(GND)
PGND: JP7.3 JP8.2 JP8.4 JP8.6 JP8.8 L6.2 PU1.24(ACN)
ETH_OUT: D7.A PU1.3(ETH)
ETH_Rx_N: PU1.8(TXN) U2.6(RD+)
ETH_Rx_P: PU1.7(TXP) U2.8(RD-)
ETH_Tx_N: PU1.10(RXN) U2.1(TD+)
ETH_Tx_P: PU1.9(RXP) U2.3(TD-)
H18: U3.8(TX)
J18: U3.9(RX)
LED_OUT: D6.A PU1.6(3.3V)
M14: JP5.2 R63.1
M15: JP5.3 R64.1
MDI0_N: U2.16(TX+)
MDI0_P: U2.14(TX-)
MDI1_N: U2.11(RX+)
MDI1_P: U2.9(RX-)
V20: JP8.1
Vplc: PU1.11(12V)
W20: JP8.3
Y18: JP8.7
Y19: JP8.5
NetC35_2: C35.2 U2.15(CM1)
NetC36_2: C36.2 U2.10(CM2)
NetC37_2: C37.2 R58.2 R59.2
NetD6_K: D6.K R61.2
NetD7_K: D7.K R62.2
NetDE1_2: DE1.2 R60.1
NetPU1_2: PU1.2(RST) R60.2
NetR58_1: R58.1 U2.2(CT1)
NetR59_1: R59.1 U2.7(CT2)

Not connected (* = marked no-connect by the designer): PU1 4(PLC)* 5(PWR)* 13(NC)* 14(NC)* 15(NC)* 16(NC)* 17(NC)* 18(NC)* 19(NC)* 21(NC)* 22(NC)* 23(NC)*; U2 4(NC1)* 5(NC2)* 12(NC4)* 13(NC3)*; U3 2(D0)* 3(D1)* 4(D2)* 5(D3)* 6(D4)* 7(D5)* 10(SDA)* 11(SCL)* 12(SWD)* 13(SWC)*

### Layout directives
differential pair: ETH_Rx_N, ETH_Rx_P, ETH_Tx_N, ETH_Tx_P

### Notes on the sheet
- PLC input
- (near U3) 9-axis Sensor
- Water Depth Sensor
- (near L6) Isolation
- Thruster
- (near JP8) 2PL
- (in symbol LW-MPA223A) PLIC

### Library data of the parts
C35-C37 = C: 无极性贴片电容; 版权归属: 源创客; BOM名称: 无极性贴片电容; 学习资源: www.ooocke.com
D6 D7 = 0603 黄灯: 发光二极管; ComponentLink1Description: 供应商链接; ComponentLink1URL: http://www.szlcsc.com/product/details_73147.html; Package: 0603; Supplier: LC; SuppliersPartNumber: C72038
DE1 = DEBUG: 调试断点焊盘; 版权归属: 源创客; BOM名称: 调试断点焊盘; 学习资源: www.ooocke.com
JP5 = Header 4: 4P接插件; 版权归属: 源创客; BOM名称: 4P接插件; 学习资源: www.ooocke.com
JP6 JP7 = Header 5: 5P接插件; 版权归属: 源创客; BOM名称: 5P接插件; 学习资源: www.ooocke.com
JP8 = Header 8: 8P接插件; 版权归属: 源创客; BOM名称: 8P接插件; 学习资源: www.ooocke.com
L6 = L: 小功率贴片电感; 版权归属: 源创客; BOM名称: 小功率贴片电感; 学习资源: www.ooocke.com
PU1 = LW-MPA223A
R58-R60 = 0603 330Ω (3300) 1%: 贴片电阻; ComponentLink1Description: 供应商链接; ComponentLink1URL: http://www.szlcsc.com/product/details_23865.html; Package: 0603; Supplier: LC; SuppliersPartNumber: C23138
R61-R64 = R: 贴片电阻; 版权归属: 源创客; BOM名称: 贴片电阻; 学习资源: www.ooocke.com
U2 = HY601742_1: 以太网变压器
U3 = WT931: 维特智能WT931九轴模块

## Sheet OurEDA-P1K_cam.SchDoc
size A4; SheetNumber: 5; SheetTotal: 7
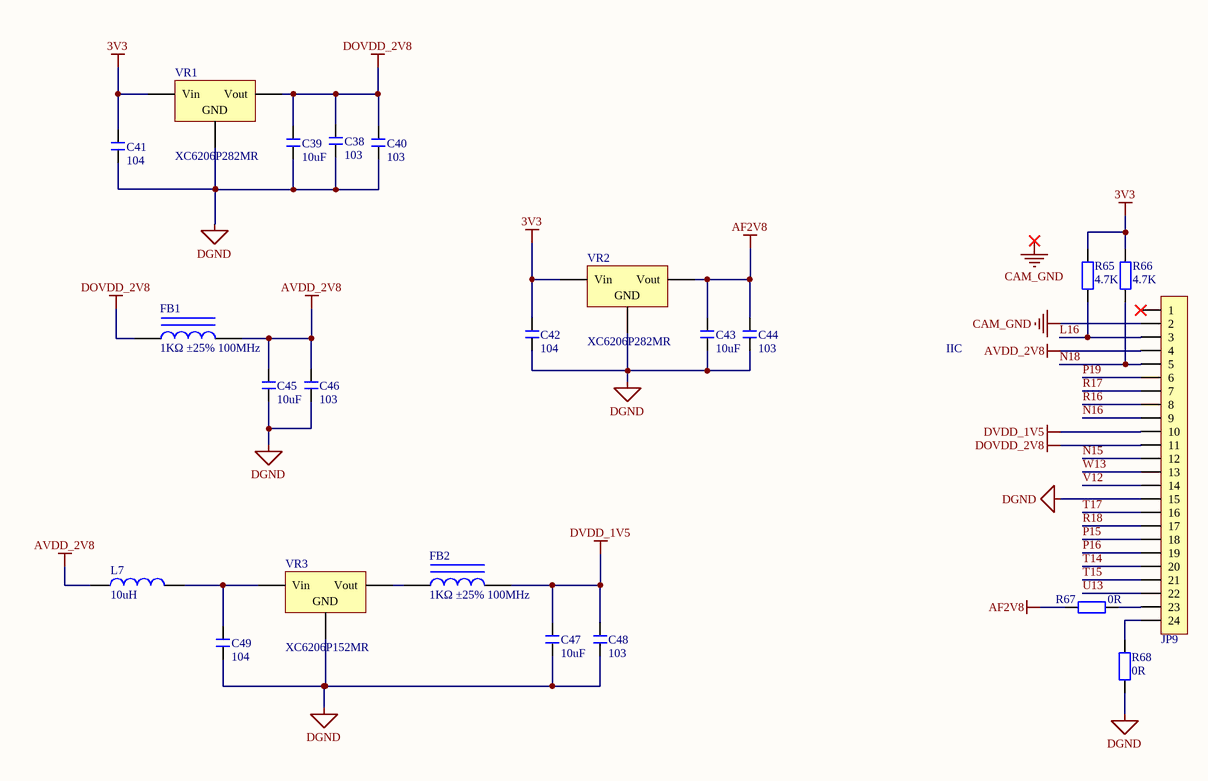
[diagram p4: OurEDA-P1K_cam.SchDoc]

### Parts
C38  103  [C 0603_L]
C39  10uF  [C 0603_L]
C40  103  [C 0603_L]
C41  104  [C 0603_L]
C42  104  [C 0603_L]
C43  10uF  [C 0603_L]
C44  103  [C 0603_L]
C45  10uF  [C 0603_L]
C46  103  [C 0603_L]
C47  10uF  [C 0603_L]
C48  103  [C 0603_L]
C49  104  [C 0603_L]
FB1  1KΩ ±25% 100MHz  [0805_L]
FB2  1KΩ ±25% 100MHz  [0805_L]
JP9  FPC1.0-24P  [FPC0.5 2H-WS-24P]  (value not drawn)
L7  10uH  [L 0805]
R65  4.7K  [R 0603_L]
R66  4.7K  [R 0603_L]
R67  0R  [R 0603_L]
R68  0R  [R 0603_L]
VR1  XC6206P282MR  [SOT-23-3L]
VR2  XC6206P282MR  [SOT-23-3L]
VR3  XC6206P152MR  [SOT-23-3L]

### Nets
3V3: C41.1 C42.1 R65.1 R66.1 VR1.3(Vin) VR2.3(Vin)
AF2V8: C43.1 C44.1 R67.1 VR2.2(Vout)
AVDD_2V8: C45.1 C46.1 FB1.2 JP9.4 L7.1
CAM_GND: JP9.2
DGND: C38.2 C39.2 C40.2 C41.2 C42.2 C43.2 C44.2 C45.2 C46.2 C47.2 C48.2 C49.2 JP9.15 R68.2 VR1.1(GND) VR2.1(GND) VR3.1(GND)
DOVDD_2V8: C38.1 C39.1 C40.1 FB1.1 JP9.11 VR1.2(Vout)
DVDD_1V5: C47.1 C48.1 FB2.2 JP9.10
L16: JP9.3 R65.2
N15: JP9.12
N16: JP9.9
N18: JP9.5 R66.2
P15: JP9.18
P16: JP9.19
P19: JP9.6
R16: JP9.8
R17: JP9.7
R18: JP9.17
T14: JP9.20
T15: JP9.21
T17: JP9.16
U13: JP9.22
V12: JP9.14
W13: JP9.13
NetC49_1: C49.1 L7.2 VR3.3(Vin)
NetFB2_1: FB2.1 VR3.2(Vout)
NetJP9_23: JP9.23 R67.2
NetJP9_24: JP9.24 R68.1

Not connected (* = marked no-connect by the designer): JP9 1*

### Notes on the sheet
- IIC
- Labels drawn without touching a wire or pin: CAM_GND

### Library data of the parts
C38-C49 = C: 无极性贴片电容; 版权归属: 源创客; BOM名称: 无极性贴片电容; 学习资源: www.ooocke.com
FB1 FB2 = 0805 600Ω 25% 100MHz: 贴片磁珠; ComponentLink1Description: 供应商链接; ComponentLink1URL: http://www.szlcsc.com/product/details_1369.html; Package: 0805; Supplier: LC; SuppliersPartNumber: C1017
JP9 = FPC-24P: FPC连接器; 版权归属: 源创客; BOM名称: FPC连接器; 学习资源: www.ooocke.com
L7 = L: 小功率贴片电感; 版权归属: 源创客; BOM名称: 小功率贴片电感; 学习资源: www.ooocke.com
R65-R68 = R: 贴片电阻; 版权归属: 源创客; BOM名称: 贴片电阻; 学习资源: www.ooocke.com
VR1-VR3 = SOT-23 XC6206P332MR: 低压差线性稳压(LDO); ComponentLink1Description: 供应商链接; ComponentLink1URL: http://www.szlcsc.com/product/details_5896.html; Package: SOT-23; Supplier: LC; SuppliersPartNumber: C5446

## Sheet OurEDA-P1K_usb.SchDoc
size A4; SheetNumber: 6; SheetTotal: 7
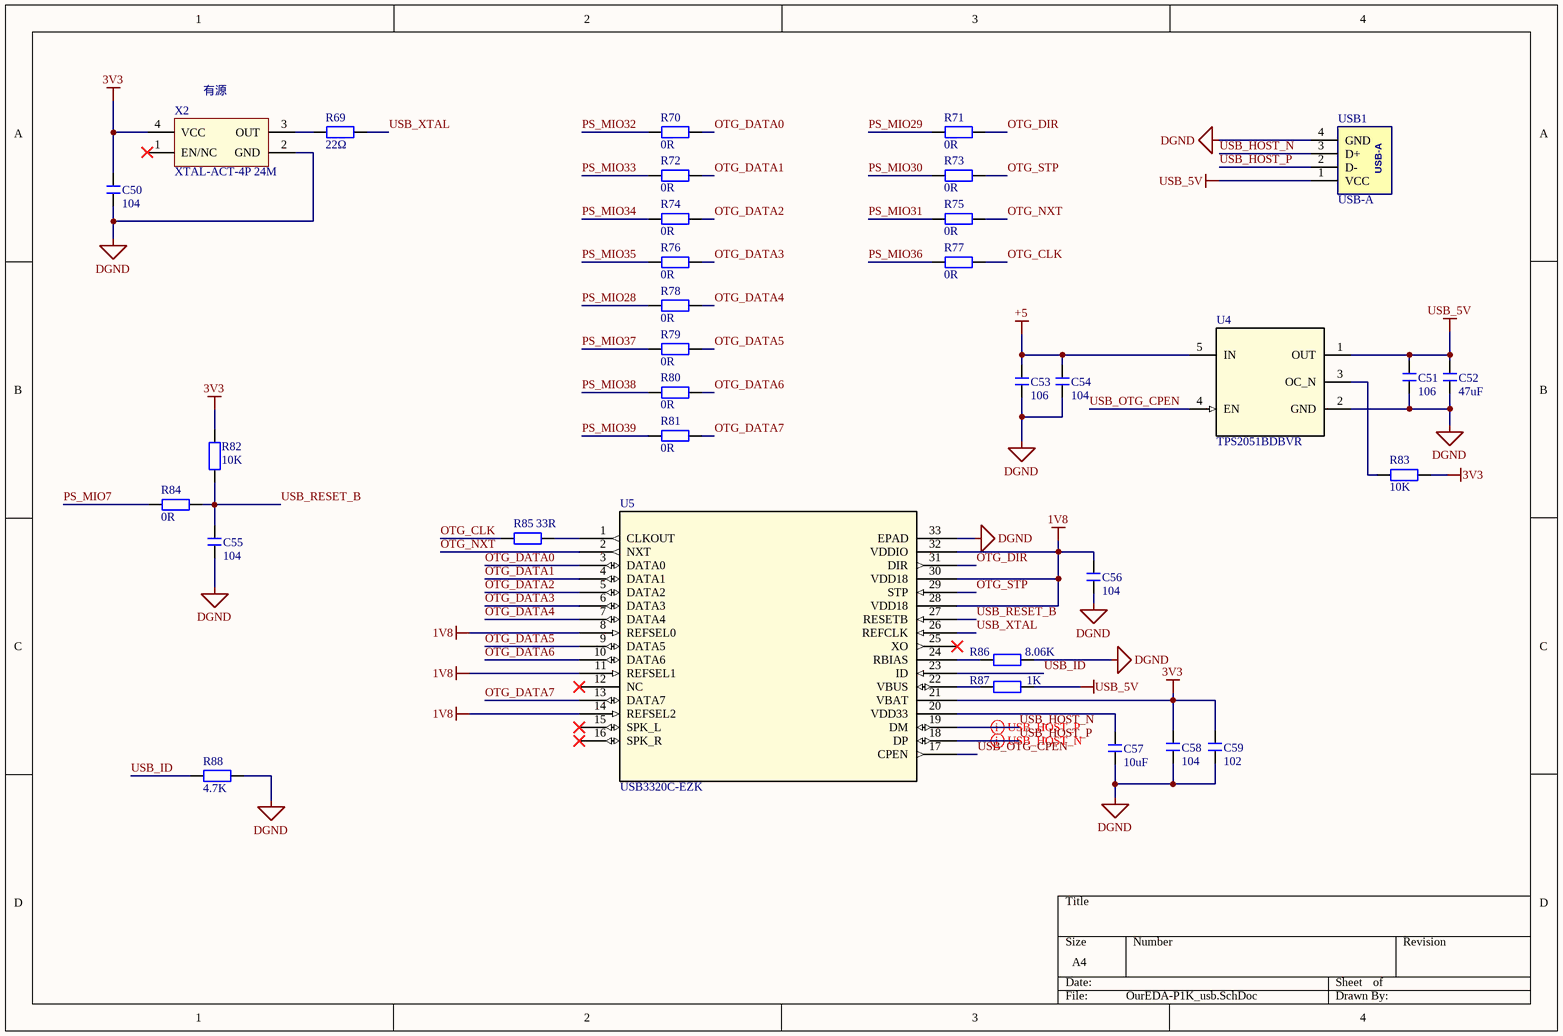
[diagram p5: OurEDA-P1K_usb.SchDoc]

### Parts
C50  104  [C 0603_L]
C51  106  [C 0603_L]
C52  47uF  [C 0603_L]
C53  106  [C 0603_L]
C54  104  [C 0603_L]
C55  104  [C 0603_L]
C56  104  [C 0603_L]
C57  10uF  [C 0603_L]
C58  104  [C 0603_L]
C59  102  [C 0603_L]
R69  22Ω  [R 0603_L]
R70  0R  [R 0603_L]
R71  0R  [R 0603_L]
R72  0R  [R 0603_L]
R73  0R  [R 0603_L]
R74  0R  [R 0603_L]
R75  0R  [R 0603_L]
R76  0R  [R 0603_L]
R77  0R  [R 0603_L]
R78  0R  [R 0603_L]
R79  0R  [R 0603_L]
R80  0R  [R 0603_L]
R81  0R  [R 0603_L]
R82  10K  [R 0603_L]
R83  10K  [R 0603_L]
R84  0R  [R 0603_L]
R85  33R  [R 0603_L]
R86  8.06K  [R 0603_L]
R87  1K  [R 0603_L]
R88  4.7K  [R 0603_L]
U4  TPS2051BDBVR  [DBV0005A_N]
U5  USB3320C-EZK  [QFN32_5X5MC_MCH]
USB1  USB-A  [USB-A/S_F]
X2  XTAL-ACT-4P 24M  [OSC 1612-4P]

### Nets
1V8: C56.2 U5.8(REFSEL0) U5.11(REFSEL1) U5.14(REFSEL2) U5.28(VDD18) U5.30(VDD18) U5.32(VDDIO)
3V3: C50.2 C58.2 C59.2 R82.2 R83.1 U5.21(VBAT) X2.4(VCC)
+5: C53.2 C54.2 U4.5(IN)
DGND: C50.1 C51.1 C52.1 C53.1 C54.1 C55.1 C56.1 C57.1 C58.1 C59.1 R86.2 R88.1 U4.2(GND) U5.33(EPAD) USB1.4(GND) X2.2(GND)
USB_5V: C51.2 C52.2 R87.2 U4.1(OUT) USB1.1(VCC)
OTG_CLK: R77.1 R85.1
OTG_DATA0: R70.1 U5.3(DATA0)
OTG_DATA1: R72.1 U5.4(DATA1)
OTG_DATA2: R74.1 U5.5(DATA2)
OTG_DATA3: R76.1 U5.6(DATA3)
OTG_DATA4: R78.1 U5.7(DATA4)
OTG_DATA5: R79.1 U5.9(DATA5)
OTG_DATA6: R80.1 U5.10(DATA6)
OTG_DATA7: R81.1 U5.13(DATA7)
OTG_DIR: R71.1 U5.31(DIR)
OTG_NXT: R75.1 U5.2(NXT)
OTG_STP: R73.1 U5.29(STP)
PS_MIO7: R84.2
PS_MIO28: R78.2
PS_MIO29: R71.2
PS_MIO30: R73.2
PS_MIO31: R75.2
PS_MIO32: R70.2
PS_MIO33: R72.2
PS_MIO34: R74.2
PS_MIO35: R76.2
PS_MIO36: R77.2
PS_MIO37: R79.2
PS_MIO38: R80.2
PS_MIO39: R81.2
USB_HOST_N: U5.19(DM) USB1.3(D+)
USB_HOST_P: U5.18(DP) USB1.2(D-)
USB_ID: R88.2 U5.23(ID)
USB_OTG_CPEN: U4.4(EN) U5.17(CPEN)
USB_RESET_B: C55.2 R82.1 R84.1 U5.27(RESETB)
USB_XTAL: R69.2 U5.26(REFCLK)
NetC57_2: C57.2 U5.20(VDD33)
NetR69_1: R69.1 X2.3(OUT)
NetR83_2: R83.2 U4.3(OC_N)
NetR85_2: R85.2 U5.1(CLKOUT)
NetR86_1: R86.1 U5.24(RBIAS)
NetR87_1: R87.1 U5.22(VBUS)

Not connected (* = marked no-connect by the designer): U5 12(NC)* 15(SPK_L)* 16(SPK_R)* 25(XO)*; X2 1(EN/NC)*

### Layout directives
differential pair: USB_HOST_N, USB_HOST_P

### Notes on the sheet
- (near X2) 有源

### Library data of the parts
C50-C59 = C: 无极性贴片电容; 版权归属: 源创客; BOM名称: 无极性贴片电容; 学习资源: www.ooocke.com
R69-R88 = R: 贴片电阻; 版权归属: 源创客; BOM名称: 贴片电阻; 学习资源: www.ooocke.com
U4 = TPS2051BDBVR: No Description Available; Mfr_Name: Texas Instruments; Alternate_PartNumber: TPS2051BDBVT; CompType: IC; Type: DEV; RefDes: RefDes; Copyright: Copyright (C) 2022 Ultra Librarian. All rights reserved.; Manufacturer_Part_Number: TPS2051BDBVR; Application_BuildNumber: *; PartNumber: TPS2051BDBVR; PackageReference: DBV0005A; MountType: SMT; RoHS: Y; Manufacturer: Texas Instruments
U5 = USB3320C-EZK: No Description Available; Mfr_Name: Microchip; Copyright: Copyright (C) 2022 Ultra Librarian. All rights reserved.; Manufacturer_Part_Number: USB3320C-EZK; RefDes: RefDes; Type: DEV
X2 = XTAL-ACT-4P: 4脚有源晶振

## Sheet OurEDA-P1K_sd.SchDoc
size A4; SheetNumber: 7; SheetTotal: 7
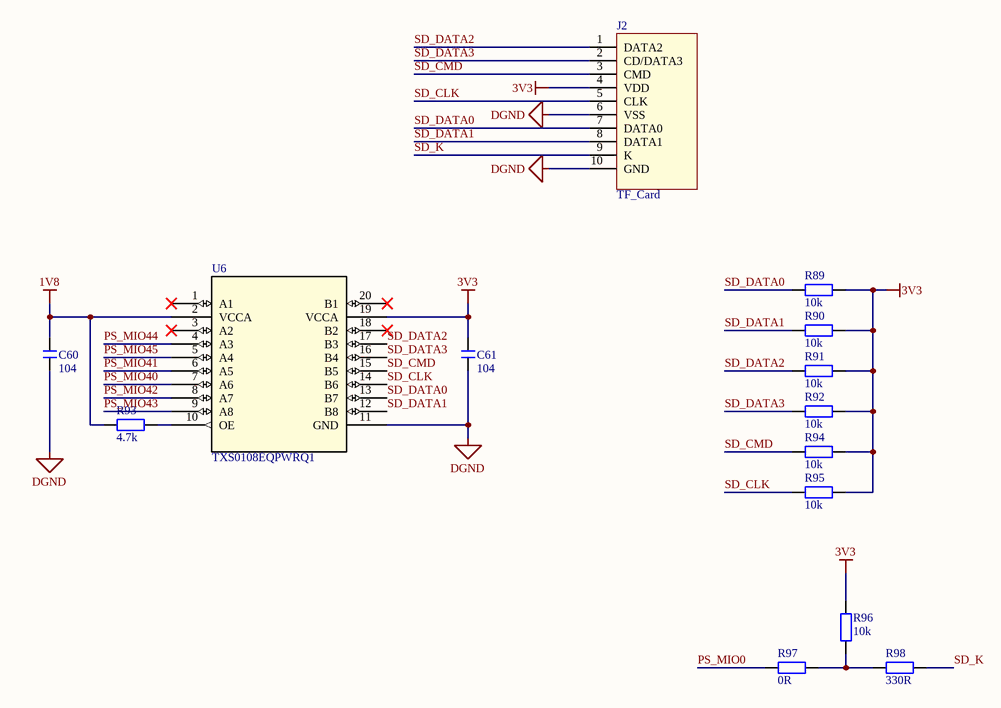
[diagram p6: OurEDA-P1K_sd.SchDoc]

### Parts
C60  104  [C 0603_L]
C61  104  [C 0603_L]
J2  TF_Card  [Micro SD]
R89  10k  [R 0603_L]
R90  10k  [R 0603_L]
R91  10k  [R 0603_L]
R92  10k  [R 0603_L]
R93  4.7k  [R 0603_L]
R94  10k  [R 0603_L]
R95  10k  [R 0603_L]
R96  10k  [R 0603_L]
R97  0R  [R 0603_L]
R98  330R  [R 0603_L]
U6  TXS0108EQPWRQ1  [PW20_TEX]

### Nets
1V8: C60.1 R93.2 U6.2(VCCA)
3V3: C61.1 J2.4(VDD) R89.1 R90.1 R91.1 R92.1 R94.1 R95.1 R96.2 U6.19(VCCA)
DGND: C60.2 C61.2 J2.6(VSS) J2.10(GND) U6.11(GND)
PS_MIO0: R97.2
PS_MIO40: U6.7(A6)
PS_MIO41: U6.6(A5)
PS_MIO42: U6.8(A7)
PS_MIO43: U6.9(A8)
PS_MIO44: U6.4(A3)
PS_MIO45: U6.5(A4)
SD_CLK: J2.5(CLK) R95.2 U6.14(B6)
SD_CMD: J2.3(CMD) R94.2 U6.15(B5)
SD_DATA0: J2.7(DATA0) R89.2 U6.13(B7)
SD_DATA1: J2.8(DATA1) R90.2 U6.12(B8)
SD_DATA2: J2.1(DATA2) R91.2 U6.17(B3)
SD_DATA3: J2.2(CD/DATA3) R92.2 U6.16(B4)
SD_K: J2.9(K) R98.1
NetR93_1: R93.1 U6.10(OE)
NetR96_1: R96.1 R97.1 R98.2

Not connected (* = marked no-connect by the designer): U6 1(A1)* 3(A2)* 18(B2)* 20(B1)*

### Library data of the parts
C60 C61 = C: 无极性贴片电容; 版权归属: 源创客; BOM名称: 无极性贴片电容; 学习资源: www.ooocke.com
J2 = TF_Card: TF卡座; 版权归属: 源创客; BOM名称: TF卡座; 学习资源: www.ooocke.com
R89-R98 = R: 贴片电阻; 版权归属: 源创客; BOM名称: 贴片电阻; 学习资源: www.ooocke.com
U6 = TXS0108EQPWRQ1: No Description Available; Mfr_Name: Texas Instruments; Copyright: Copyright (C) 2022 Ultra Librarian. All rights reserved.; Manufacturer_Part_Number: TXS0108EQPWRQ1; RefDes: RefDes; Type: DEV

## Nets that join several sheets
1V8: OurEDA-P1K_Network (9 pins), OurEDA-P1K_zynq (J1.7 J1.8), OurEDA-P1K_usb (7 pins), OurEDA-P1K_sd (C60.1 R93.2 U6.2)
3V3: OurEDA-P1K_PowerManagement (E6.1 L3.2 R12.2), OurEDA-P1K_Network (C23.2 C24.2 R20.1), OurEDA-P1K_zynq (7 pins), OurEDA-P1K_sensor (5 pins), OurEDA-P1K_cam (6 pins), OurEDA-P1K_usb (7 pins), OurEDA-P1K_sd (10 pins)
6V: OurEDA-P1K_PowerManagement (E4.1 L2.2 R7.2), OurEDA-P1K_sensor (JP7.2)
+5: OurEDA-P1K_PowerManagement (5 pins), OurEDA-P1K_zynq (J1.1 J1.2 J1.3 J1.4), OurEDA-P1K_sensor (JP5.1), OurEDA-P1K_usb (C53.2 C54.2 U4.5)
+12: OurEDA-P1K_PowerManagement (7 pins), OurEDA-P1K_sensor (5 pins)
+24: OurEDA-P1K_PowerManagement (17 pins), OurEDA-P1K_sensor (PU1.20)
DGND: OurEDA-P1K_PowerManagement (9 pins), OurEDA-P1K_Network (26 pins), OurEDA-P1K_zynq (43 pins), OurEDA-P1K_sensor (12 pins), OurEDA-P1K_cam (17 pins), OurEDA-P1K_usb (16 pins), OurEDA-P1K_sd (5 pins)
PGND: OurEDA-P1K_PowerManagement (33 pins), OurEDA-P1K_sensor (7 pins)
H18: OurEDA-P1K_zynq (J1.146), OurEDA-P1K_sensor (U3.8)
J18: OurEDA-P1K_zynq (J1.144), OurEDA-P1K_sensor (U3.9)
L16: OurEDA-P1K_zynq (J1.112), OurEDA-P1K_cam (JP9.3 R65.2)
M14: OurEDA-P1K_zynq (J1.148), OurEDA-P1K_sensor (JP5.2 R63.1)
M15: OurEDA-P1K_zynq (J1.150), OurEDA-P1K_sensor (JP5.3 R64.1)
MDC_FPGA: OurEDA-P1K_Network (R28.1), OurEDA-P1K_zynq (J1.196)
MDI0_N: OurEDA-P1K_Network (U1.2), OurEDA-P1K_sensor (U2.16)
MDI0_P: OurEDA-P1K_Network (U1.1), OurEDA-P1K_sensor (U2.14)
MDI1_N: OurEDA-P1K_Network (U1.5), OurEDA-P1K_sensor (U2.11)
MDI1_P: OurEDA-P1K_Network (U1.4), OurEDA-P1K_sensor (U2.9)
MDIO_FPGA: OurEDA-P1K_Network (R31.1), OurEDA-P1K_zynq (J1.198)
N15: OurEDA-P1K_zynq (J1.98), OurEDA-P1K_cam (JP9.12)
N16: OurEDA-P1K_zynq (J1.100), OurEDA-P1K_cam (JP9.9)
N18: OurEDA-P1K_zynq (J1.108), OurEDA-P1K_cam (JP9.5 R66.2)
P15: OurEDA-P1K_zynq (J1.64), OurEDA-P1K_cam (JP9.18)
P16: OurEDA-P1K_zynq (J1.62), OurEDA-P1K_cam (JP9.19)
P19: OurEDA-P1K_zynq (J1.106), OurEDA-P1K_cam (JP9.6)
PS_MIO0: OurEDA-P1K_zynq (J1.18), OurEDA-P1K_sd (R97.2)
PS_MIO7: OurEDA-P1K_zynq (J1.24), OurEDA-P1K_usb (R84.2)
PS_MIO16: OurEDA-P1K_Network (R48.2), OurEDA-P1K_zynq (J1.176)
PS_MIO17: OurEDA-P1K_Network (R44.2), OurEDA-P1K_zynq (J1.171)
PS_MIO18: OurEDA-P1K_Network (R42.2), OurEDA-P1K_zynq (J1.175)
PS_MIO19: OurEDA-P1K_Network (R40.2), OurEDA-P1K_zynq (J1.177)
PS_MIO20: OurEDA-P1K_Network (R36.2), OurEDA-P1K_zynq (J1.179)
PS_MIO21: OurEDA-P1K_Network (R46.2), OurEDA-P1K_zynq (J1.172)
PS_MIO22: OurEDA-P1K_Network (R47.2), OurEDA-P1K_zynq (J1.181)
PS_MIO23: OurEDA-P1K_Network (R43.2), OurEDA-P1K_zynq (J1.178)
PS_MIO24: OurEDA-P1K_Network (R41.2), OurEDA-P1K_zynq (J1.180)
PS_MIO25: OurEDA-P1K_Network (R39.2), OurEDA-P1K_zynq (J1.170)
PS_MIO26: OurEDA-P1K_Network (R35.2), OurEDA-P1K_zynq (J1.182)
PS_MIO27: OurEDA-P1K_Network (R45.2), OurEDA-P1K_zynq (J1.169)
PS_MIO28: OurEDA-P1K_zynq (J1.42), OurEDA-P1K_usb (R78.2)
PS_MIO29: OurEDA-P1K_zynq (J1.36), OurEDA-P1K_usb (R71.2)
PS_MIO30: OurEDA-P1K_zynq (J1.44), OurEDA-P1K_usb (R73.2)
PS_MIO31: OurEDA-P1K_zynq (J1.41), OurEDA-P1K_usb (R75.2)
PS_MIO32: OurEDA-P1K_zynq (J1.34), OurEDA-P1K_usb (R70.2)
PS_MIO33: OurEDA-P1K_zynq (J1.31), OurEDA-P1K_usb (R72.2)
PS_MIO34: OurEDA-P1K_zynq (J1.32), OurEDA-P1K_usb (R74.2)
PS_MIO35: OurEDA-P1K_zynq (J1.39), OurEDA-P1K_usb (R76.2)
PS_MIO36: OurEDA-P1K_zynq (J1.29), OurEDA-P1K_usb (R77.2)
PS_MIO37: OurEDA-P1K_zynq (J1.35), OurEDA-P1K_usb (R79.2)
PS_MIO38: OurEDA-P1K_zynq (J1.33), OurEDA-P1K_usb (R80.2)
PS_MIO39: OurEDA-P1K_zynq (J1.40), OurEDA-P1K_usb (R81.2)
PS_MIO40: OurEDA-P1K_zynq (J1.183), OurEDA-P1K_sd (U6.7)
PS_MIO41: OurEDA-P1K_zynq (J1.193), OurEDA-P1K_sd (U6.6)
PS_MIO42: OurEDA-P1K_zynq (J1.184), OurEDA-P1K_sd (U6.8)
PS_MIO43: OurEDA-P1K_zynq (J1.200), OurEDA-P1K_sd (U6.9)
PS_MIO44: OurEDA-P1K_zynq (J1.186), OurEDA-P1K_sd (U6.4)
PS_MIO45: OurEDA-P1K_zynq (J1.189), OurEDA-P1K_sd (U6.5)
PS_POR_B: OurEDA-P1K_Network (C31.1 U1.29), OurEDA-P1K_zynq (J1.26)
R16: OurEDA-P1K_zynq (J1.102), OurEDA-P1K_cam (JP9.8)
R17: OurEDA-P1K_zynq (J1.104), OurEDA-P1K_cam (JP9.7)
R18: OurEDA-P1K_zynq (J1.66), OurEDA-P1K_cam (JP9.17)
T14: OurEDA-P1K_zynq (J1.60), OurEDA-P1K_cam (JP9.20)
T15: OurEDA-P1K_zynq (J1.58), OurEDA-P1K_cam (JP9.21)
T17: OurEDA-P1K_zynq (J1.68), OurEDA-P1K_cam (JP9.16)
U13: OurEDA-P1K_zynq (J1.54), OurEDA-P1K_cam (JP9.22)
V12: OurEDA-P1K_zynq (J1.94), OurEDA-P1K_cam (JP9.14)
V20: OurEDA-P1K_zynq (J1.135), OurEDA-P1K_sensor (JP8.1)
Vplc: OurEDA-P1K_PowerManagement (C3.1 C4.1 D1.2 E2.1), OurEDA-P1K_sensor (PU1.11)
W13: OurEDA-P1K_zynq (J1.96), OurEDA-P1K_cam (JP9.13)
W20: OurEDA-P1K_zynq (J1.133), OurEDA-P1K_sensor (JP8.3)
Y18: OurEDA-P1K_zynq (J1.129), OurEDA-P1K_sensor (JP8.7)
Y19: OurEDA-P1K_zynq (J1.131), OurEDA-P1K_sensor (JP8.5)